# EAGLE schematic NEW LINE EN (EAGLE 9.6.2)

## Sheet 1 of 2
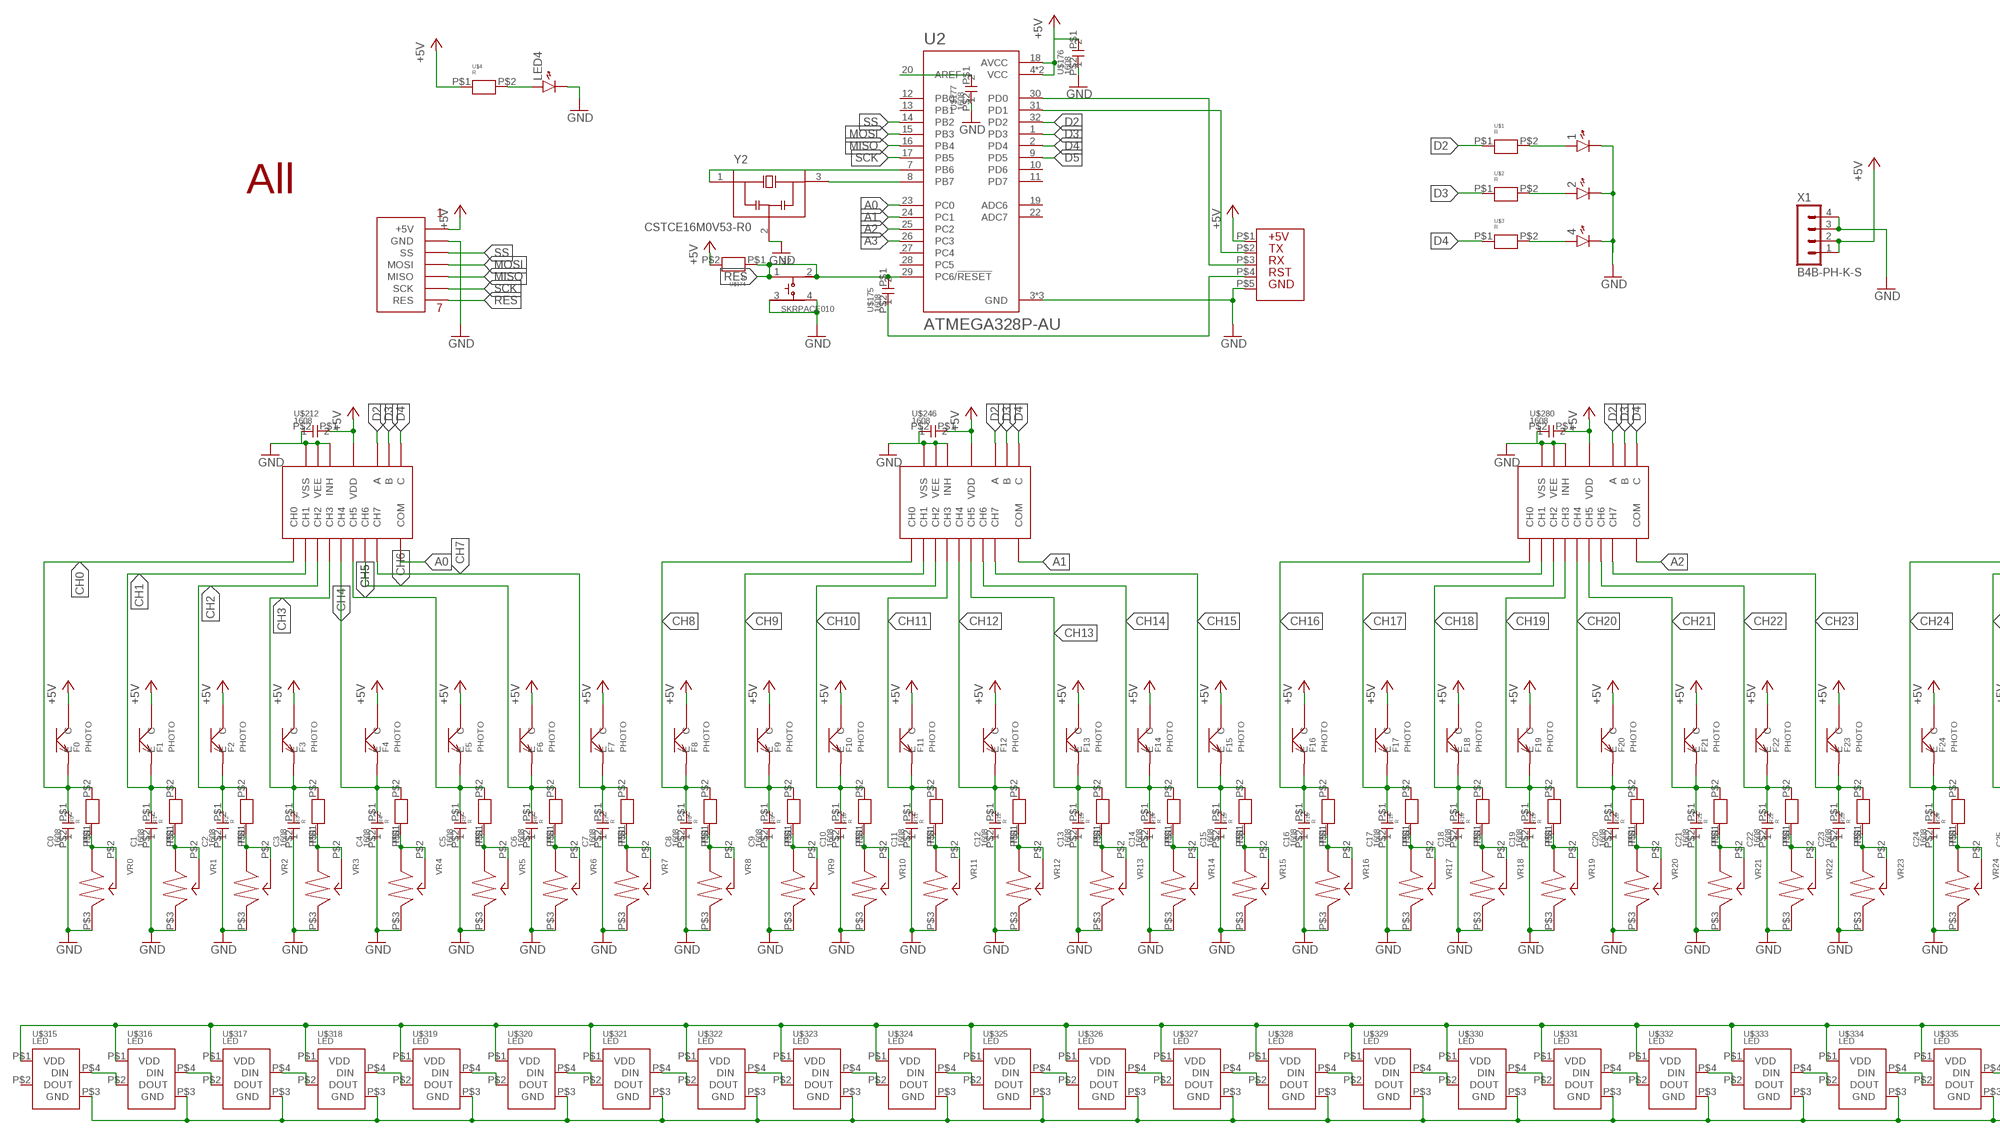
[diagram p0: schematic, sheet 1, part 1 of 2]
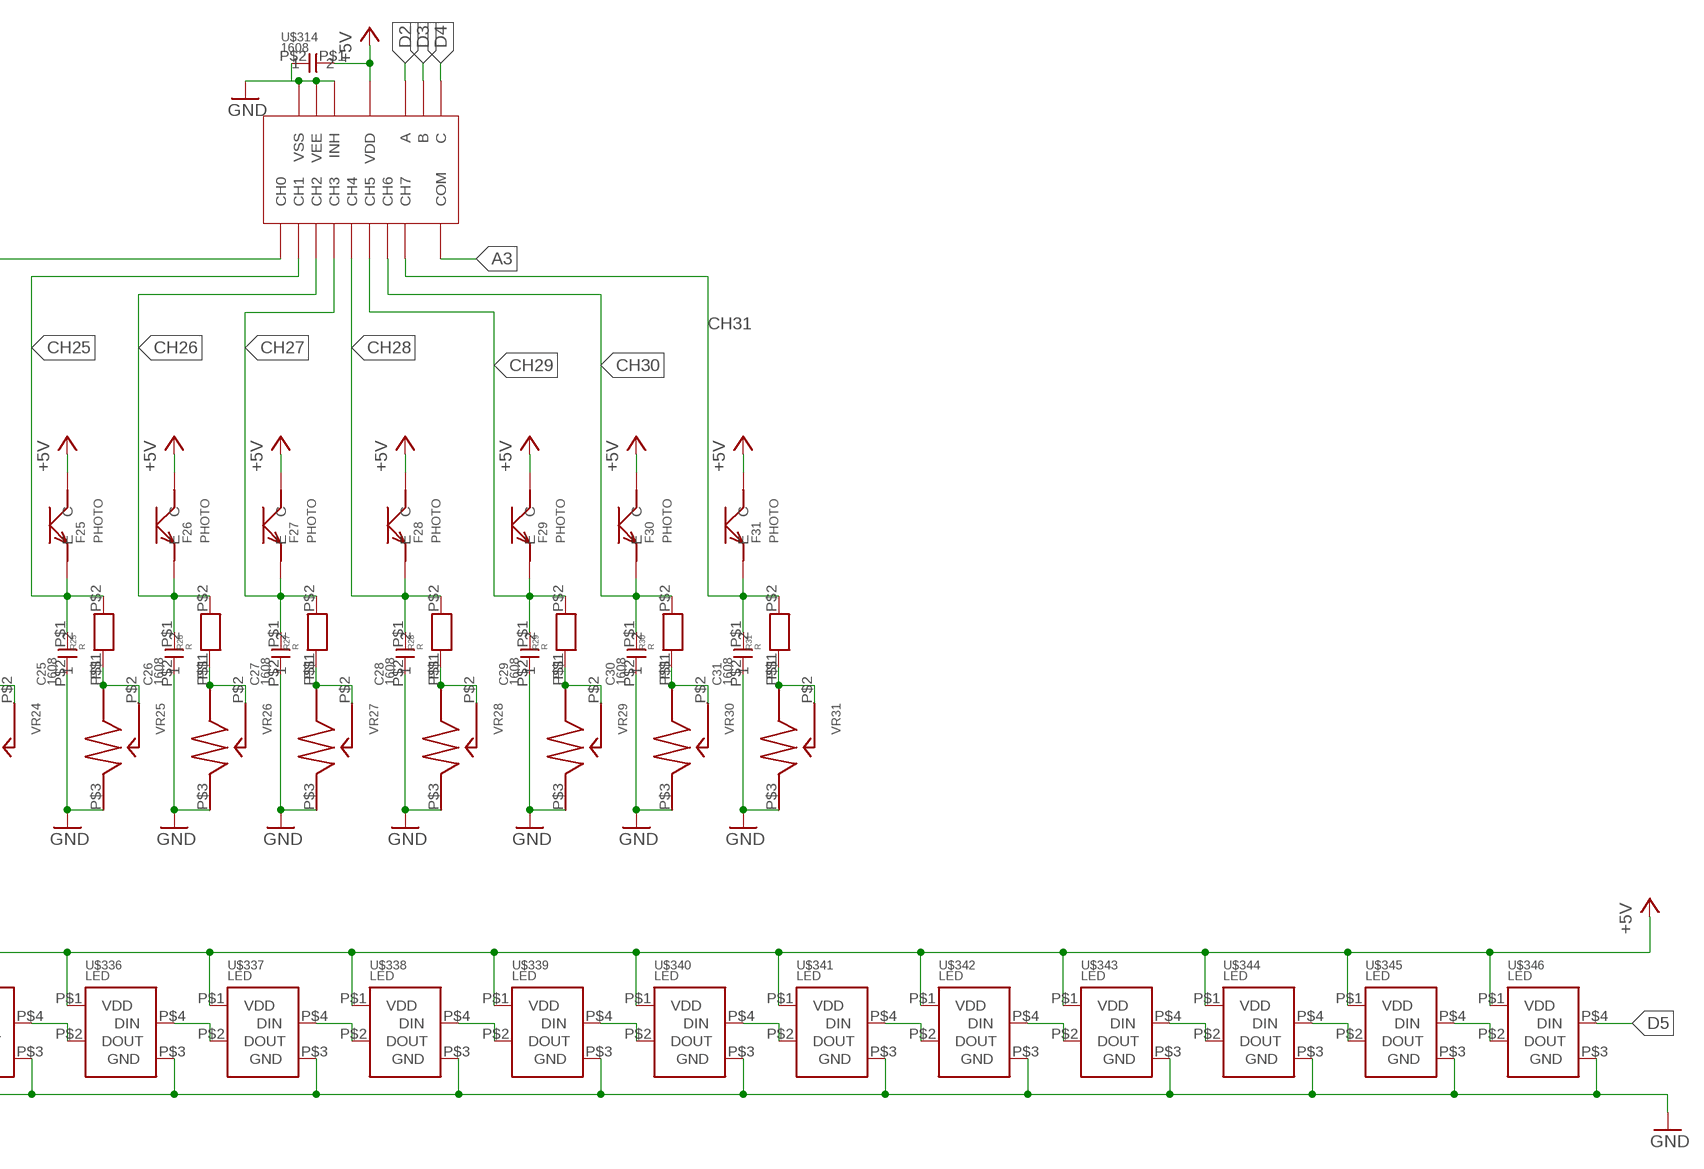
[diagram p1: schematic, sheet 1, part 2 of 2]

### Parts
1  LED1608  [LED1608]
2  LED1608  [LED1608]
4  LED1608  [LED1608]
C0  1608  [CON]
C1  1608  [CON]
C2  1608  [CON]
C3  1608  [CON]
C4  1608  [CON]
C5  1608  [CON]
C6  1608  [CON]
C7  1608  [CON]
C8  1608  [CON]
C9  1608  [CON]
C10  1608  [CON]
C11  1608  [CON]
C12  1608  [CON]
C13  1608  [CON]
C14  1608  [CON]
C15  1608  [CON]
C16  1608  [CON]
C17  1608  [CON]
C18  1608  [CON]
C19  1608  [CON]
C20  1608  [CON]
C21  1608  [CON]
C22  1608  [CON]
C23  1608  [CON]
C24  1608  [CON]
C25  1608  [CON]
C26  1608  [CON]
C27  1608  [CON]
C28  1608  [CON]
C29  1608  [CON]
C30  1608  [CON]
C31  1608  [CON]
F0  PHOTO  [PHOTO]
F1  PHOTO  [PHOTO]
F2  PHOTO  [PHOTO]
F3  PHOTO  [PHOTO]
F4  PHOTO  [PHOTO]
F5  PHOTO  [PHOTO]
F6  PHOTO  [PHOTO]
F7  PHOTO  [PHOTO]
F8  PHOTO  [PHOTO]
F9  PHOTO  [PHOTO]
F10  PHOTO  [PHOTO]
F11  PHOTO  [PHOTO]
F12  PHOTO  [PHOTO]
F13  PHOTO  [PHOTO]
F14  PHOTO  [PHOTO]
F15  PHOTO  [PHOTO]
F16  PHOTO  [PHOTO]
F17  PHOTO  [PHOTO]
F18  PHOTO  [PHOTO]
F19  PHOTO  [PHOTO]
F20  PHOTO  [PHOTO]
F21  PHOTO  [PHOTO]
F22  PHOTO  [PHOTO]
F23  PHOTO  [PHOTO]
F24  PHOTO  [PHOTO]
F25  PHOTO  [PHOTO]
F26  PHOTO  [PHOTO]
F27  PHOTO  [PHOTO]
F28  PHOTO  [PHOTO]
F29  PHOTO  [PHOTO]
F30  PHOTO  [PHOTO]
F31  PHOTO  [PHOTO]
LED4  LED1608  [LED1608]
R0  R  [1608]
R1  R  [1608]
R2  R  [1608]
R3  R  [1608]
R4  R  [1608]
R5  R  [1608]
R6  R  [1608]
R7  R  [1608]
R8  R  [1608]
R9  R  [1608]
R10  R  [1608]
R11  R  [1608]
R12  R  [1608]
R13  R  [1608]
R14  R  [1608]
R15  R  [1608]
R16  R  [1608]
R17  R  [1608]
R18  R  [1608]
R19  R  [1608]
R20  R  [1608]
R21  R  [1608]
R22  R  [1608]
R23  R  [1608]
R24  R  [1608]
R25  R  [1608]
R26  R  [1608]
R27  R  [1608]
R28  R  [1608]
R29  R  [1608]
R30  R  [1608]
R31  R  [1608]
S2  SKRPACE010  [SW_SKRPACE010]
U2  ATMEGA328P-AU  [QFP80P900X900X120-32N]
U$1  R  [1608]
U$2  R  [1608]
U$3  R  [1608]
U$4  R  [1608]
U$5  SPI  [SPI]
U$6  SI  [SI]
U$7  ALL  [ALL]
U$174  R  [1608]
U$175  1608  [CON]
U$176  1608  [CON]
U$177  1608  [CON]
U$179  AM  [SOP65P640X120-16N]
U$212  1608  [CON]
U$213  AM  [SOP65P640X120-16N]
U$246  1608  [CON]
U$247  AM  [SOP65P640X120-16N]
U$280  1608  [CON]
U$281  AM  [SOP65P640X120-16N]
U$314  1608  [CON]
U$315  LED  [LED]
U$316  LED  [LED]
U$317  LED  [LED]
U$318  LED  [LED]
U$319  LED  [LED]
U$320  LED  [LED]
U$321  LED  [LED]
U$322  LED  [LED]
U$323  LED  [LED]
U$324  LED  [LED]
U$325  LED  [LED]
U$326  LED  [LED]
U$327  LED  [LED]
U$328  LED  [LED]
U$329  LED  [LED]
U$330  LED  [LED]
U$331  LED  [LED]
U$332  LED  [LED]
U$333  LED  [LED]
U$334  LED  [LED]
U$335  LED  [LED]
U$336  LED  [LED]
U$337  LED  [LED]
U$338  LED  [LED]
U$339  LED  [LED]
U$340  LED  [LED]
U$341  LED  [LED]
U$342  LED  [LED]
U$343  LED  [LED]
U$344  LED  [LED]
U$345  LED  [LED]
U$346  LED  [LED]
VR0  VR  [VR]
VR1  VR  [VR]
VR2  VR  [VR]
VR3  VR  [VR]
VR4  VR  [VR]
VR5  VR  [VR]
VR6  VR  [VR]
VR7  VR  [VR]
VR8  VR  [VR]
VR9  VR  [VR]
VR10  VR  [VR]
VR11  VR  [VR]
VR12  VR  [VR]
VR13  VR  [VR]
VR14  VR  [VR]
VR15  VR  [VR]
VR16  VR  [VR]
VR17  VR  [VR]
VR18  VR  [VR]
VR19  VR  [VR]
VR20  VR  [VR]
VR21  VR  [VR]
VR22  VR  [VR]
VR23  VR  [VR]
VR24  VR  [VR]
VR25  VR  [VR]
VR26  VR  [VR]
VR27  VR  [VR]
VR28  VR  [VR]
VR29  VR  [VR]
VR30  VR  [VR]
VR31  VR  [VR]
X1  B4B-PH-K-S  [B4B-PH-K-S]
Y2  CSTCE16M0V53-R0  [OSC_CSTCE16M0V53-R0]

### Nets
+5V: F0.P$1(C) F1.P$1(C) F2.P$1(C) F3.P$1(C) F4.P$1(C) F5.P$1(C) F6.P$1(C) F7.P$1(C) F8.P$1(C) F9.P$1(C) F10.P$1(C) F11.P$1(C) F12.P$1(C) F13.P$1(C) F14.P$1(C) F15.P$1(C) F16.P$1(C) F17.P$1(C) F18.P$1(C) F19.P$1(C) F20.P$1(C) F21.P$1(C) F22.P$1(C) F23.P$1(C) F24.P$1(C) F25.P$1(C) F26.P$1(C) F27.P$1(C) F28.P$1(C) F29.P$1(C) F30.P$1(C) F31.P$1(C) U2.4(VCC) U2.6(VCC) U2.18(AVCC) U$4.P$1 U$5.P$1(+5V) U$6.P$1 U$174.P$2 U$176.P$1 U$179.16(VDD) U$212.P$1 U$213.16(VDD) U$246.P$1 U$247.16(VDD) U$280.P$1 U$281.16(VDD) U$314.P$1 U$315.P$1(VDD) U$316.P$1(VDD) U$317.P$1(VDD) U$318.P$1(VDD) U$319.P$1(VDD) U$320.P$1(VDD) U$321.P$1(VDD) U$322.P$1(VDD) U$323.P$1(VDD) U$324.P$1(VDD) U$325.P$1(VDD) U$326.P$1(VDD) U$327.P$1(VDD) U$328.P$1(VDD) U$329.P$1(VDD) U$330.P$1(VDD) U$331.P$1(VDD) U$332.P$1(VDD) U$333.P$1(VDD) U$334.P$1(VDD) U$335.P$1(VDD) U$336.P$1(VDD) U$337.P$1(VDD) U$338.P$1(VDD) U$339.P$1(VDD) U$340.P$1(VDD) U$341.P$1(VDD) U$342.P$1(VDD) U$343.P$1(VDD) U$344.P$1(VDD) U$345.P$1(VDD) U$346.P$1(VDD) X1.1 X1.2
A0: U2.23(PC0) U$179.3(COM)
A1: U2.24(PC1) U$213.3(COM)
A2: U2.25(PC2) U$247.3(COM)
A3: U2.26(PC3) U$281.3(COM)
CH0: C0.P$1 F0.P$2(E) R0.P$2 U$179.13(CH0)
CH1: C1.P$1 F1.P$2(E) R1.P$2 U$179.14(CH1)
CH2: C2.P$1 F2.P$2(E) R2.P$2 U$179.15(CH2)
CH3: C3.P$1 F3.P$2(E) R3.P$2 U$179.12(CH3)
CH4: C4.P$1 F4.P$2(E) R4.P$2 U$179.1(CH4)
CH5: C5.P$1 F5.P$2(E) R5.P$2 U$179.5(CH5)
CH6: C6.P$1 F6.P$2(E) R6.P$2 U$179.2(CH6)
CH7: C7.P$1 F7.P$2(E) R7.P$2 U$179.4(CH7)
CH8: C8.P$1 F8.P$2(E) R8.P$2 U$213.13(CH0)
CH9: C9.P$1 F9.P$2(E) R9.P$2 U$213.14(CH1)
CH10: C10.P$1 F10.P$2(E) R10.P$2 U$213.15(CH2)
CH11: C11.P$1 F11.P$2(E) R11.P$2 U$213.12(CH3)
CH12: C12.P$1 F12.P$2(E) R12.P$2 U$213.1(CH4)
CH13: C13.P$1 F13.P$2(E) R13.P$2 U$213.5(CH5)
CH14: C14.P$1 F14.P$2(E) R14.P$2 U$213.2(CH6)
CH15: C15.P$1 F15.P$2(E) R15.P$2 U$213.4(CH7)
CH16: C16.P$1 F16.P$2(E) R16.P$2 U$247.13(CH0)
CH17: C17.P$1 F17.P$2(E) R17.P$2 U$247.14(CH1)
CH18: C18.P$1 F18.P$2(E) R18.P$2 U$247.15(CH2)
CH19: C19.P$1 F19.P$2(E) R19.P$2 U$247.12(CH3)
CH20: C20.P$1 F20.P$2(E) R20.P$2 U$247.1(CH4)
CH21: C21.P$1 F21.P$2(E) R21.P$2 U$247.5(CH5)
CH22: C22.P$1 F22.P$2(E) R22.P$2 U$247.2(CH6)
CH23: C23.P$1 F23.P$2(E) R23.P$2 U$247.4(CH7)
CH24: C24.P$1 F24.P$2(E) R24.P$2 U$281.13(CH0)
CH25: C25.P$1 F25.P$2(E) R25.P$2 U$281.14(CH1)
CH26: C26.P$1 F26.P$2(E) R26.P$2 U$281.15(CH2)
CH27: C27.P$1 F27.P$2(E) R27.P$2 U$281.12(CH3)
CH28: C28.P$1 F28.P$2(E) R28.P$2 U$281.1(CH4)
CH29: C29.P$1 F29.P$2(E) R29.P$2 U$281.5(CH5)
CH30: C30.P$1 F30.P$2(E) R30.P$2 U$281.2(CH6)
CH31: C31.P$1 F31.P$2(E) R31.P$2 U$281.4(CH7)
D2: U2.32(PD2) U$1.P$1 U$179.11(A) U$213.11(A) U$247.11(A) U$281.11(A)
D3: U2.1(PD3) U$2.P$1 U$179.10(B) U$213.10(B) U$247.10(B) U$281.10(B)
D4: U2.2(PD4) U$3.P$1 U$179.9(C) U$213.9(C) U$247.9(C) U$281.9(C)
D5: U2.9(PD5) U$346.P$4(DIN)
GND: 1.K 2.K 4.K C0.P$2 C1.P$2 C2.P$2 C3.P$2 C4.P$2 C5.P$2 C6.P$2 C7.P$2 C8.P$2 C9.P$2 C10.P$2 C11.P$2 C12.P$2 C13.P$2 C14.P$2 C15.P$2 C16.P$2 C17.P$2 C18.P$2 C19.P$2 C20.P$2 C21.P$2 C22.P$2 C23.P$2 C24.P$2 C25.P$2 C26.P$2 C27.P$2 C28.P$2 C29.P$2 C30.P$2 C31.P$2 LED4.K S2.3 S2.4 U2.3(GND) U2.5(GND) U2.21(GND) U$5.P$2(GND) U$6.P$5 U$176.P$2 U$177.P$2 U$179.6(INH) U$179.7(VEE) U$179.8(VSS) U$212.P$2 U$213.6(INH) U$213.7(VEE) U$213.8(VSS) U$246.P$2 U$247.6(INH) U$247.7(VEE) U$247.8(VSS) U$280.P$2 U$281.6(INH) U$281.7(VEE) U$281.8(VSS) U$314.P$2 U$315.P$3(GND) U$316.P$3(GND) U$317.P$3(GND) U$318.P$3(GND) U$319.P$3(GND) U$320.P$3(GND) U$321.P$3(GND) U$322.P$3(GND) U$323.P$3(GND) U$324.P$3(GND) U$325.P$3(GND) U$326.P$3(GND) U$327.P$3(GND) U$328.P$3(GND) U$329.P$3(GND) U$330.P$3(GND) U$331.P$3(GND) U$332.P$3(GND) U$333.P$3(GND) U$334.P$3(GND) U$335.P$3(GND) U$336.P$3(GND) U$337.P$3(GND) U$338.P$3(GND) U$339.P$3(GND) U$340.P$3(GND) U$341.P$3(GND) U$342.P$3(GND) U$343.P$3(GND) U$344.P$3(GND) U$345.P$3(GND) U$346.P$3(GND) VR0.P$3 VR1.P$3 VR2.P$3 VR3.P$3 VR4.P$3 VR5.P$3 VR6.P$3 VR7.P$3 VR8.P$3 VR9.P$3 VR10.P$3 VR11.P$3 VR12.P$3 VR13.P$3 VR14.P$3 VR15.P$3 VR16.P$3 VR17.P$3 VR18.P$3 VR19.P$3 VR20.P$3 VR21.P$3 VR22.P$3 VR23.P$3 VR24.P$3 VR25.P$3 VR26.P$3 VR27.P$3 VR28.P$3 VR29.P$3 VR30.P$3 VR31.P$3 X1.3 X1.4 Y2.2(GND)
MISO: U2.16(PB4) U$5.P$5(MISO)
MOSI: U2.15(PB3) U$5.P$4(MOSI)
N$1: 4.A U$3.P$2
N$2: 2.A U$2.P$2
N$3: 1.A U$1.P$2
N$4: LED4.A U$4.P$2
N$51: U2.20(AREF) U$177.P$1
N$69: U$6.P$4 U$175.P$2
N$70: U2.31(PD1) U$6.P$2
N$78: U2.30(PD0) U$6.P$3
N$79: U2.7(PB6) Y2.1(IN)
N$81: U2.8(PB7) Y2.3(OUT)
N$83: R0.P$1 VR0.P$1 VR0.P$2
N$84: R1.P$1 VR1.P$1 VR1.P$2
N$85: R2.P$1 VR2.P$1 VR2.P$2
N$86: R3.P$1 VR3.P$1 VR3.P$2
N$87: R4.P$1 VR4.P$1 VR4.P$2
N$88: R5.P$1 VR5.P$1 VR5.P$2
N$89: R6.P$1 VR6.P$1 VR6.P$2
N$90: R7.P$1 VR7.P$1 VR7.P$2
N$92: R8.P$1 VR8.P$1 VR8.P$2
N$93: R9.P$1 VR9.P$1 VR9.P$2
N$94: R10.P$1 VR10.P$1 VR10.P$2
N$95: R11.P$1 VR11.P$1 VR11.P$2
N$96: R12.P$1 VR12.P$1 VR12.P$2
N$97: R13.P$1 VR13.P$1 VR13.P$2
N$98: R14.P$1 VR14.P$1 VR14.P$2
N$99: R15.P$1 VR15.P$1 VR15.P$2
N$101: R16.P$1 VR16.P$1 VR16.P$2
N$102: R17.P$1 VR17.P$1 VR17.P$2
N$103: R18.P$1 VR18.P$1 VR18.P$2
N$104: R19.P$1 VR19.P$1 VR19.P$2
N$105: R20.P$1 VR20.P$1 VR20.P$2
N$106: R21.P$1 VR21.P$1 VR21.P$2
N$107: R22.P$1 VR22.P$1 VR22.P$2
N$108: R23.P$1 VR23.P$1 VR23.P$2
N$110: R24.P$1 VR24.P$1 VR24.P$2
N$111: R25.P$1 VR25.P$1 VR25.P$2
N$112: R26.P$1 VR26.P$1 VR26.P$2
N$113: R27.P$1 VR27.P$1 VR27.P$2
N$114: R28.P$1 VR28.P$1 VR28.P$2
N$115: R29.P$1 VR29.P$1 VR29.P$2
N$116: R30.P$1 VR30.P$1 VR30.P$2
N$117: R31.P$1 VR31.P$1 VR31.P$2
N$118: U$315.P$4(DIN) U$316.P$2(DOUT)
N$119: U$316.P$4(DIN) U$317.P$2(DOUT)
N$120: U$319.P$4(DIN) U$320.P$2(DOUT)
N$121: U$320.P$4(DIN) U$321.P$2(DOUT)
N$122: U$321.P$4(DIN) U$322.P$2(DOUT)
N$123: U$317.P$4(DIN) U$318.P$2(DOUT)
N$124: U$318.P$4(DIN) U$319.P$2(DOUT)
N$125: U$323.P$4(DIN) U$324.P$2(DOUT)
N$126: U$324.P$4(DIN) U$325.P$2(DOUT)
N$127: U$327.P$4(DIN) U$328.P$2(DOUT)
N$128: U$328.P$4(DIN) U$329.P$2(DOUT)
N$129: U$329.P$4(DIN) U$330.P$2(DOUT)
N$130: U$325.P$4(DIN) U$326.P$2(DOUT)
N$131: U$326.P$4(DIN) U$327.P$2(DOUT)
N$132: U$331.P$4(DIN) U$332.P$2(DOUT)
N$133: U$332.P$4(DIN) U$333.P$2(DOUT)
N$134: U$335.P$4(DIN) U$336.P$2(DOUT)
N$135: U$336.P$4(DIN) U$337.P$2(DOUT)
N$136: U$337.P$4(DIN) U$338.P$2(DOUT)
N$137: U$333.P$4(DIN) U$334.P$2(DOUT)
N$138: U$334.P$4(DIN) U$335.P$2(DOUT)
N$139: U$339.P$4(DIN) U$340.P$2(DOUT)
N$140: U$340.P$4(DIN) U$341.P$2(DOUT)
N$141: U$343.P$4(DIN) U$344.P$2(DOUT)
N$142: U$344.P$4(DIN) U$345.P$2(DOUT)
N$143: U$345.P$4(DIN) U$346.P$2(DOUT)
N$144: U$341.P$4(DIN) U$342.P$2(DOUT)
N$145: U$342.P$4(DIN) U$343.P$2(DOUT)
N$146: U$322.P$4(DIN) U$323.P$2(DOUT)
N$147: U$330.P$4(DIN) U$331.P$2(DOUT)
N$148: U$338.P$4(DIN) U$339.P$2(DOUT)
RES: S2.1 S2.2 U2.29(PC6/!RESET) U$5.P$7(RES) U$174.P$1 U$175.P$1
SCK: U2.17(PB5) U$5.P$6(SCK)
SS: U2.14(PB2) U$5.P$3(SS)
Unconnected: U2.10(PD6) U2.11(PD7) U2.12(PB0) U2.13(PB1) U2.19(ADC6) U2.22(ADC7) U2.27(PC4) U2.28(PC5) U$315.P$2(DOUT)

## Sheet 2 of 2

## Library data of the parts
1 2 4 LED4 = generic:LED: Generic LEDs
C0 C1-C31 U$175-U$177 U$212 U$246 U$280 U$314 = con1608:1608
F0 F1-F31 = Chip phototransistor:PHOTO
R0 R1-R31 U$1-U$4 U$174 = R 1608:R
S2 = SKRPACE010:SKRPACE010: Switch Tactile N.O. SPST Button J-Bend 0.05A 16VDC 2.55N SMD Automotive T/R Check prices <https://pricing.snapeda.com/parts/SKRPACE010/ALPS/view-part?ref=eda>; AVAILABILITY: In Stock; DESCRIPTION: Switch Tactile N.O. SPST Button J-Bend 0.05A 16VDC 2.55N SMD Automotive T/R; MF: ALPS; MP: SKRPACE010; PACKAGE: None; PRICE: None
U2 = ATMEGA328P-AU:ATMEGA328P-AU: ATmega Series 20 MHz 32 KB Flash 2 KB SRAM 8-Bit Microcontroller - TQFP-32 Check prices <https://pricing.snapeda.com/parts/ATMEGA328P-AU/Microchip%20Technology/view-part?ref=eda>; AVAILABILITY: In Stock; DESCRIPTION: AVR AVR® ATmega Microcontroller IC 8-Bit 20MHz 32KB (16K x 16) FLASH 32-TQFP (7x7); MF: Microchip Technology; MP: ATMEGA328P-AU; PACKAGE: TQFP-32 Microchip; PRICE: None
U$5 = SPI用PH7ピン:SPI
U$6 = プログラム入力:SI
U$7 = All_outlook:ALL
U$179 U$213 U$247 U$281 = アナログマルチプレクサ:AM
U$315-U$346 = フルカラーLED:LED
VR0 VR1-VR31 = VR tippu:VR
X1 = con-JST PH:B4B-PH: JST PH series header 2.00mm pitch disconnectable crimp style connectors, vertical (side entry type), 4 pins
Y2 = CSTCE16M0V53-R0:CSTCE16M0V53-R0: 20MHz Ceramic Resonator Built in Capacitor 15pF +/- 0.2% -40C - 125C Surface Mount; MANUFACTURER: Murata; MAXIMUM_PACKAGE_HEIGHT: 1.00mm; PARTREV: May 7, 2019; STANDARD: Manufacturer Recommendations

## Net classes
0 default: width 0.203 mm, clearance 0.127 mm